# EAGLE schematic RFD900module (EAGLE 6.3)
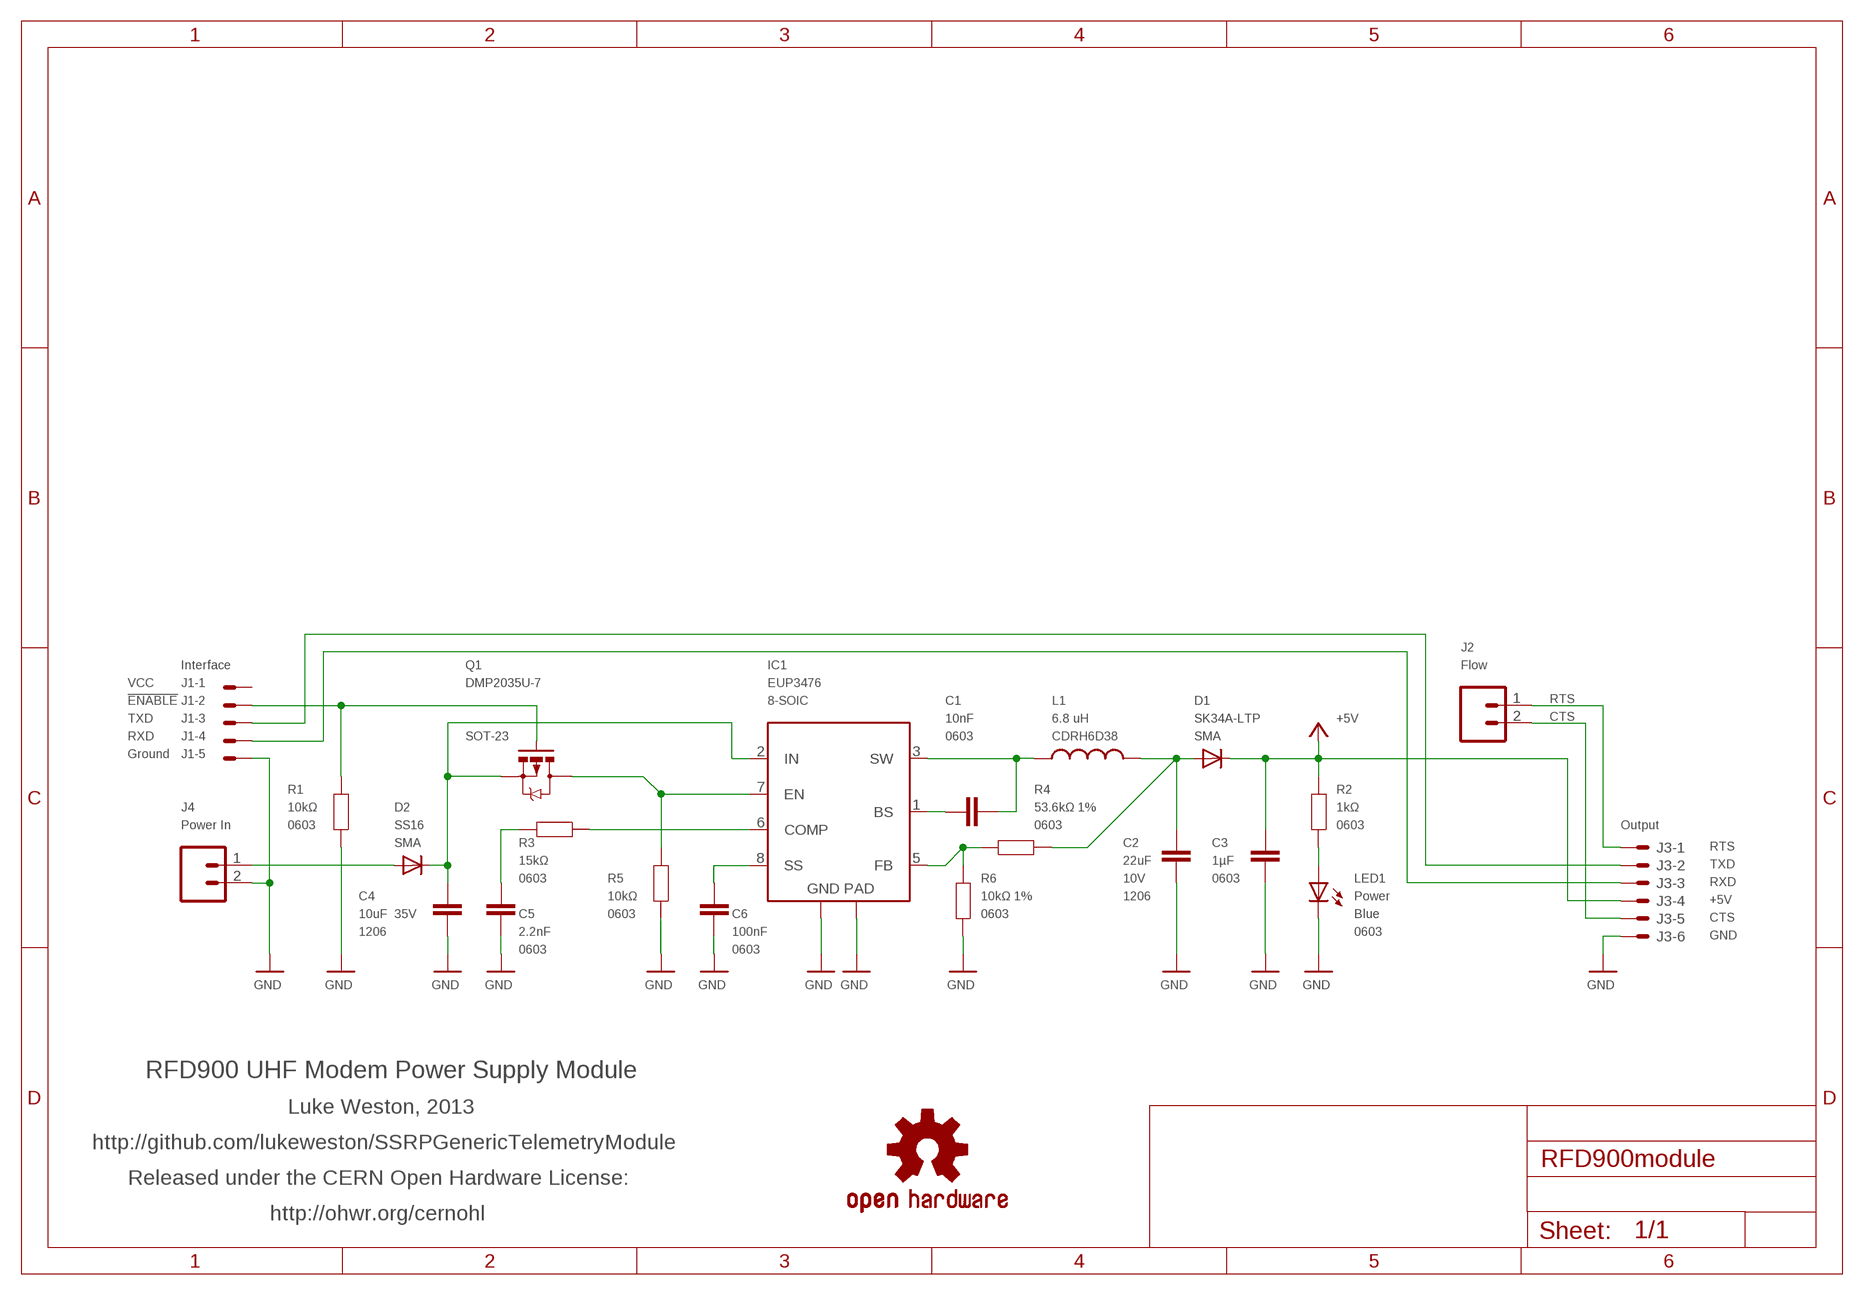
[diagram p0: schematic, sheet 1]

## Parts
C1  10nF  CAP0603  [0603]
C2  22uF  C-EUC1206  [C1206]
C3  1µF  CAP0603  [0603]
C4  10uF  C-EUC1206  [C1206]
C5  2.2nF  CAP0603  [0603]
C6  100nF  CAP0603  [0603]
D1  SK34A-LTP  DIODESMA  [SMA-DIODE]
D2  SS16  DIODESMAB  [SMA-SMB-DIODE]
IC1  EUP3476  [SO08T]
J1  Interface  22-23-2051  [22-23-2051]
J2  Flow  M02PTH  [1X02]
J3  Output  22-23-2061  [22-23-2061]
J4  Power In  M023.5MM  [SCREWTERMINAL-3.5MM-2]
L1  6.8 uH  INDUCTOR  [CDRH]
LED1  Power  LED0603  [LED-0603]
Q1  DMP2035U-7  [SOT23-3]
R1  10kΩ  RESISTOR0603  [0603]
R2  1kΩ  RESISTOR0603  [0603]
R3  15kΩ  RESISTOR0603  [0603]
R4  53.6kΩ 1%  RESISTOR0603  [0603]
R5  10kΩ  RESISTOR0603  [0603]
R6  10kΩ 1%  RESISTOR0603  [0603]
SY  OSHW-LOGOS  [OSHW-LOGO-S]

## Nets
!ENABLE: J1.2 Q1.1(G) R1.1
+5V: C3.2 D1.C J3.4 R2.1
CTS: J2.2 J3.5
GND: C2.2 C3.1 C4.2 C5.1 C6.1 IC1.4(GND) IC1.9(TGND) J1.5 J3.6 J4.2 LED1.C R1.2 R5.2 R6.2
N$1: D2.A J4.1
N$2: IC1.7(EN) Q1.3(D) R5.1
N$3: LED1.A R2.2
N$5: C2.1 D1.A L1.2 R4.2
N$18: C1.1 IC1.3(SW) L1.1
N$19: C1.2 IC1.1(BS)
N$20: C5.2 R3.2
N$21: IC1.6(COMP) R3.1
N$22: C6.2 IC1.8(SS)
N$23: IC1.5(FB) R4.1 R6.1
RTS: J2.1 J3.1
RXD: J1.4 J3.3
TXD: J1.3 J3.2
VIN: C4.1 D2.C IC1.2(IN) Q1.2(S)
Unconnected: J1.1

## Notes on the sheet
- VCC
- !ENABLE
- TXD
- RXD
- Ground
- RTS
- TXD
- RXD
- +5V
- CTS
- GND
- RFD900 UHF Modem Power Supply Module
- Luke Weston, 2013
- http://github.com/lukeweston/SSRPGenericTelemetryModule
- Released under the CERN Open Hardware License:
- http://ohwr.org/cernohl

## Library data of the parts
C1 C3 C5 C6 = freetronics-master-v1:CAP: Capacitor Standard 0603 ceramic capacitor, and 0.1" leaded capacitor.; PACKAGE: 0603
C2 = freetronics-jon:C-EU: CAPACITOR, European symbol; PACKAGE: 1206; VOLTAGE: 10V
C4 = freetronics-jon:C-EU: CAPACITOR, European symbol; PACKAGE: 1206; VOLTAGE: 35V
D1 = freetronics-master-v1:DIODE: Diode These are standard reverse protection diodes and small signal diodes. SMA package can handle up to about 1A. SOD-323 can handle about 200mA. What the SOD-323 package when ordering, there are some mfgs out there that are 5-pin packages.; PACKAGE: SMA
D2 = freetronics-jon:DIODE: Diode These are standard reverse protection diodes and small signal diodes. SMA package can handle up to about 1A. SOD-323 can handle about 200mA. What the SOD-323 package when ordering, there are some mfgs out there that are 5-pin packages.; PACKAGE: SMA
IC1 = freetronics-luke:EUP3476: EUTECH EUP3476 buck converter; PACKAGE: 8-SOIC
J1 = con-molex:22-23-2051: .100" (2.54mm) Center Header - 5 Pin; MF: MOLEX; MPN: 22-23-2051; OC_FARNELL: 1462952; OC_NEWARK: 38C9178
J2 J4 = freetronics-master-v1:M02: Header 2 Standard 2-pin 0.1" header. Use with straight break away headers (SKU : PRT-00116), right angle break away headers (PRT-00553), swiss pins (PRT-00743), machine pins (PRT-00117), and female headers (PRT-00115). Molex polarized connector foot print use with SKU : PRT-08233 with associated crimp pins and housings.
J3 = con-molex:22-23-2061: .100" (2.54mm) Center Header - 6 Pin; MF: MOLEX; MPN: 22-23-2061; OC_FARNELL: 1462922; OC_NEWARK: 27C1933
L1 = freetronics-luke:INDUCTOR; SKU: CDRH6D38
LED1 = freetronics-master-v1:LED: LEDs Standard schematic elements and footprints for 5mm, 3mm, 1206, and 0603 sized LEDs. 5mm - Spark Fun Electronics SKU : COM-00529 (and others); COLOUR: Blue; PACKAGE: 0603
Q1 = freetronics-luke:DMP2035U-7: DMP2035U P-channel MOSFET in SOT-23.; PACKAGE: SOT-23
R1-R6 = freetronics-master-v1:RESISTOR: Resistor Basic schematic elements and footprints for 0603, 1206, and PTH 1/10th watt (small) resistors.; PACKAGE: 0603
SY = SparkFun:OSHW-LOGO: Open Source Hardware Logo This logo indicates the piece of hardware it is found on incorporates a OSHW license and/or adheres to the definition of open source hardware found here: http://freedomdefined.org/OSHW